# EasyEDA schematic 02 - EasyEDA.json
TITLE: ESPresense Sensors; REV: 1.0; Date: 2022-07-13; Sheet: 1/1; Drawn By: ShonP40; Company: https://shon.codes
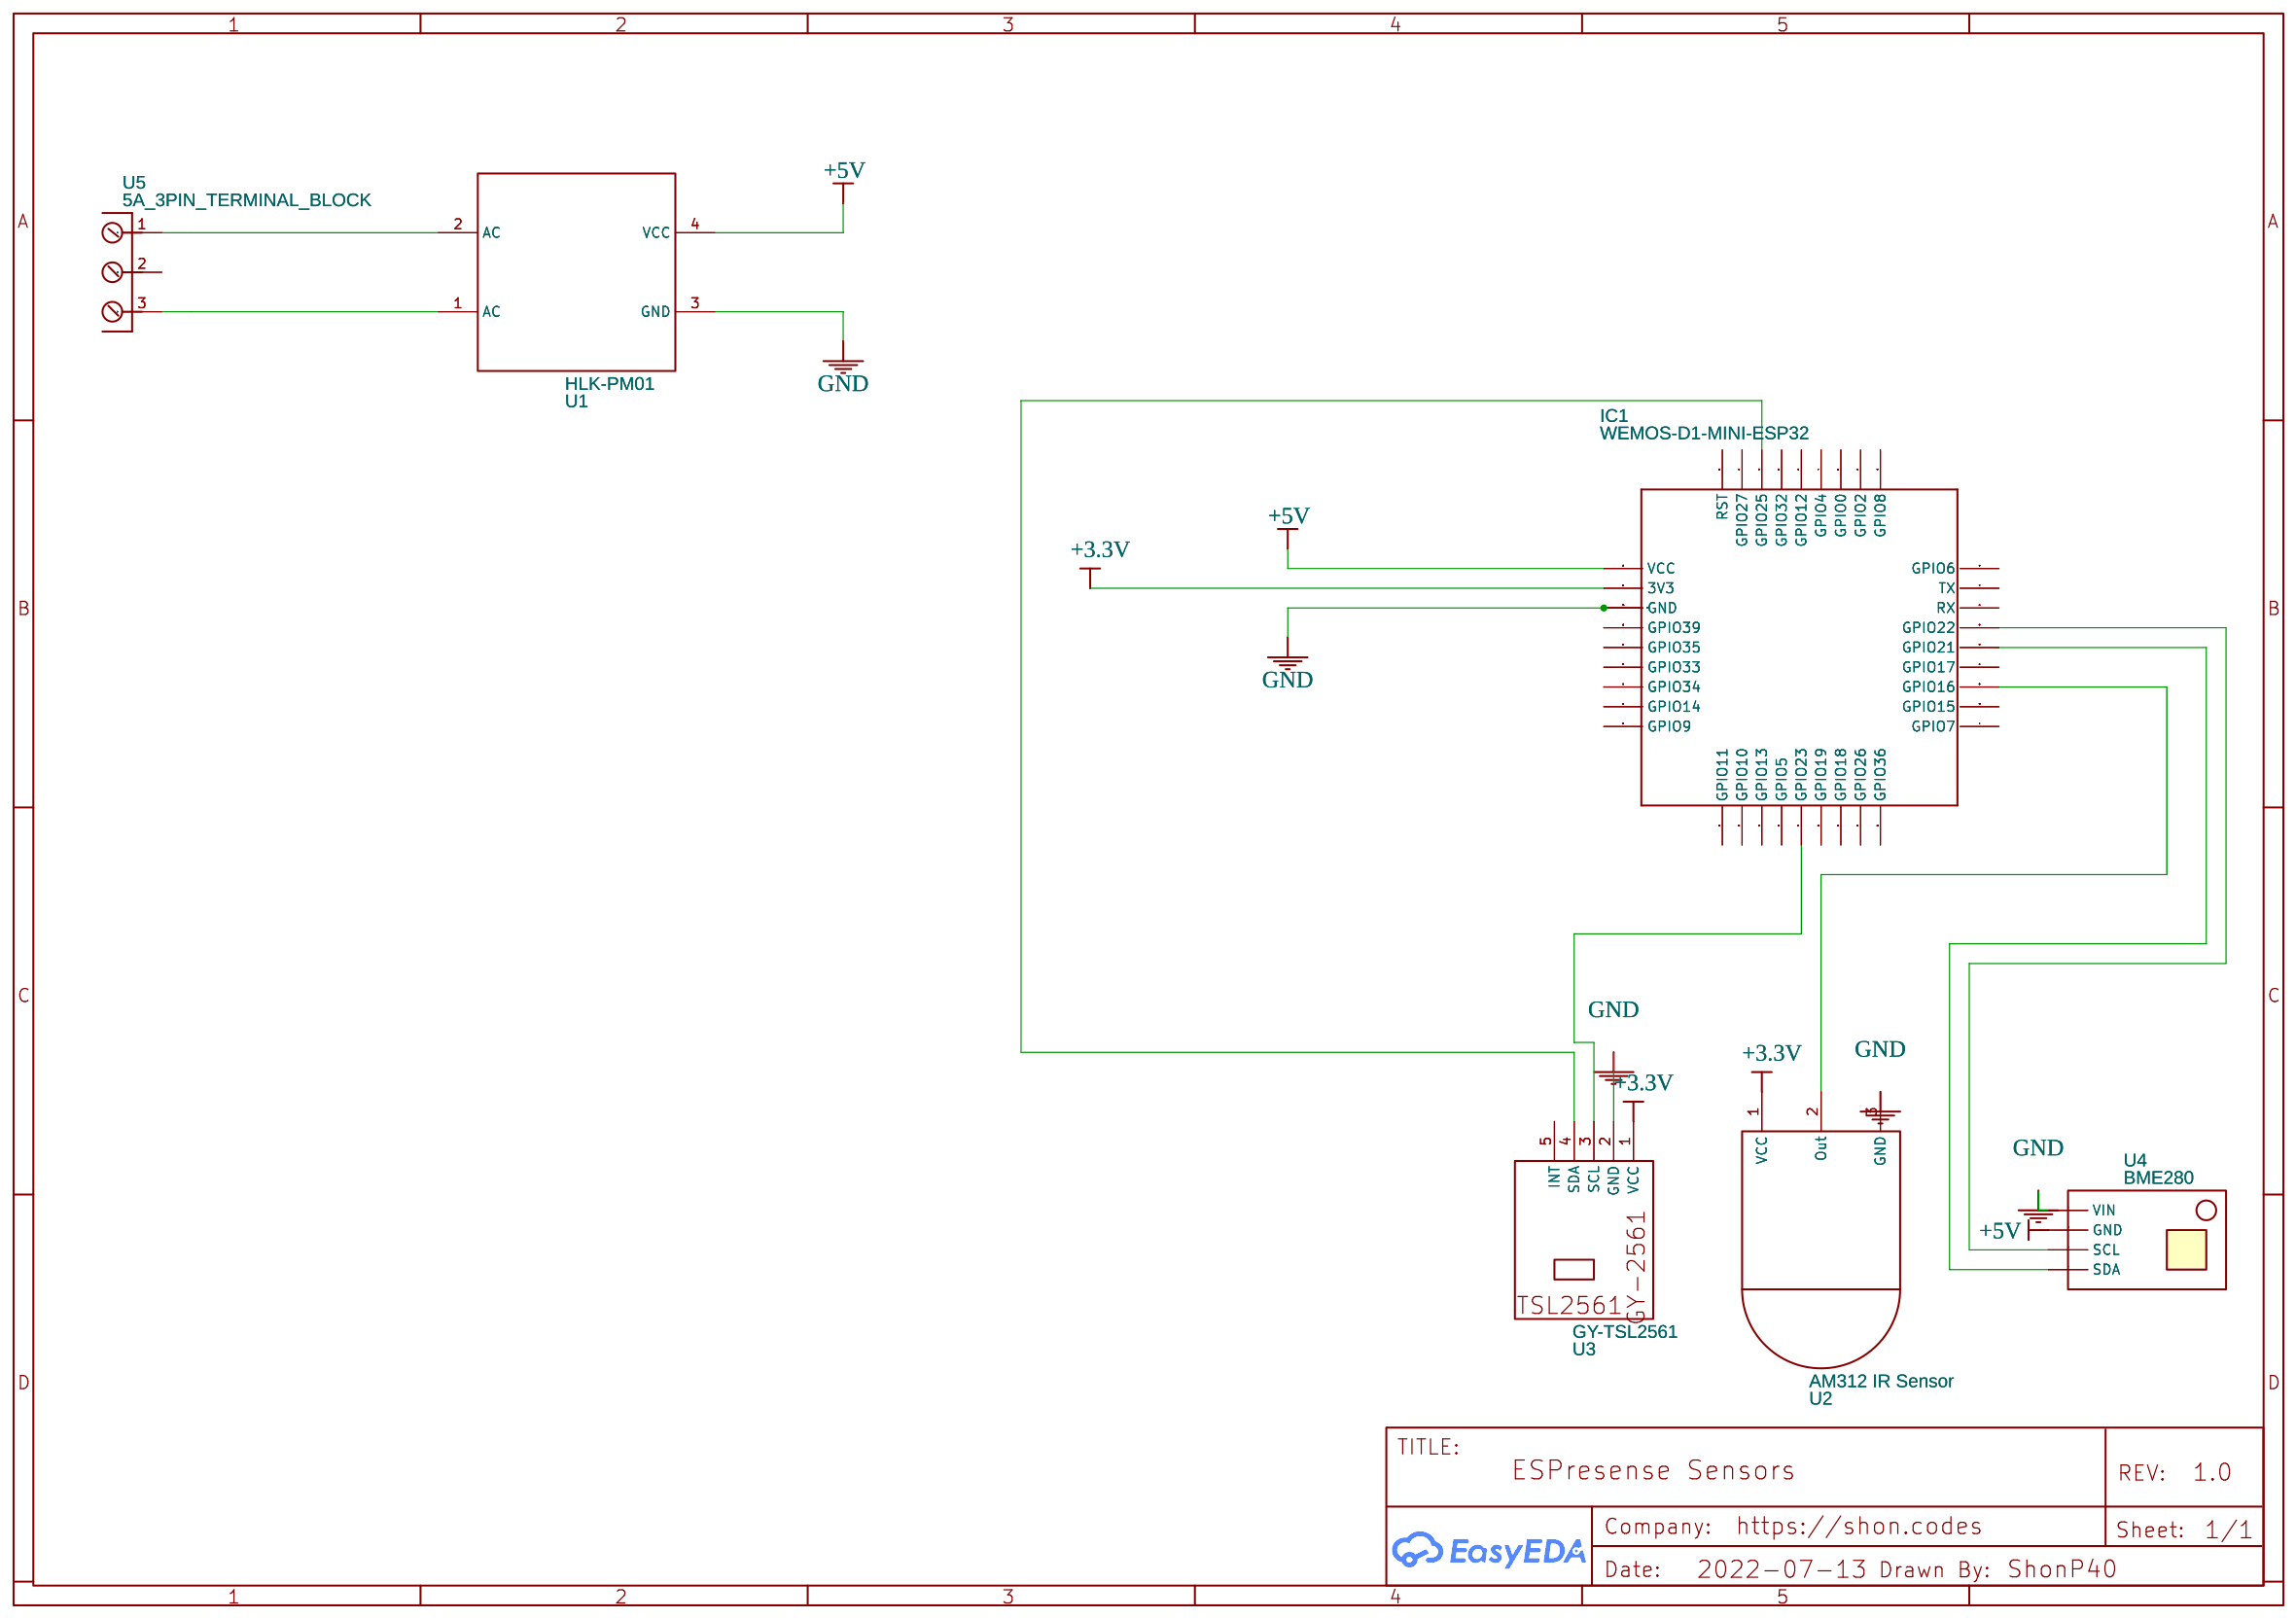
[diagram p0: schematic sheet]

## Parts
IC1  WEMOS-D1-MINI-ESP32  [WEMOS-D1-MINI-ESP32]
U1  HLK-PM01  [HLK-PM01]
U2  AM312 IR Sensor  [AM312 IR SENSOR]
U3  GY-TSL2561  [GY-TSL2561]
U4  BME280  [BME280]
U5  5A_3PIN_TERMINAL_BLOCK  [5A_3PIN_TEMINAL_BLOCK]

## Library data of the parts
IC1 = WEMOS-D1-MINI-ESP32: Contributor: ALEXANDER BLANDON
U1 = HLK-PM01: Contributor: nicolarampo99
U2 = AM312 IR Sensor: Contributor: daddyandco
U3 = GY-TSL2561: Contributor: Alex
U4 = BME280: Contributor: miralabs; Supplier: Bosch; link: https://www.bosch-sensortec.com/bst/products/all_products/bmp280
U5 = 5A_3PIN_TERMINAL_BLOCK: Contributor: Hipocrates

## Nets
+3.3V: IC1.3V3 U2.1(VCC) U3.1(VCC)
+5V: IC1.VCC U1.4(VCC) U4.2(GND)
GND: IC1.GND1(GND) IC1.GND2(GND) IC1.GND3(GND) U1.3(GND) U2.3(GND) U3.2(GND) U4.1(VIN)
Net-(IC1-16): IC1.16(GPIO16) U2.2(Out)
Net-(IC1-21): IC1.21(GPIO21) U4.4(SDA)
Net-(IC1-22): IC1.22(GPIO22) U4.3(SCL)
Net-(IC1-23): IC1.23(GPIO23) U3.3(SCL)
Net-(IC1-25): IC1.25(GPIO25) U3.4(SDA)
Net-(U1-1): U1.1(AC) U5.3
Net-(U1-2): U1.2(AC) U5.1

Not connected (* = marked no-connect by the designer): IC1 0(GPIO0) 2(GPIO2) 4(GPIO4) 5(GPIO5) 6(GPIO6) 7(GPIO7) 8(GPIO8) 9(GPIO9) 10(GPIO10) 11(GPIO11) 12(GPIO12) 13(GPIO13) 14(GPIO14) 15(GPIO15) 17(GPIO17) 18(GPIO18) 19(GPIO19) 26(GPIO26) 27(GPIO27) 32(GPIO32) 33(GPIO33) 34(GPIO34) 35(GPIO35) 36(GPIO36) 39(GPIO39) RST RX TX; U3 5(INT); U5 2
